# Altium schematic sheet DAC.SchDoc
size A4; SheetNumber: 8; SheetTotal: 11
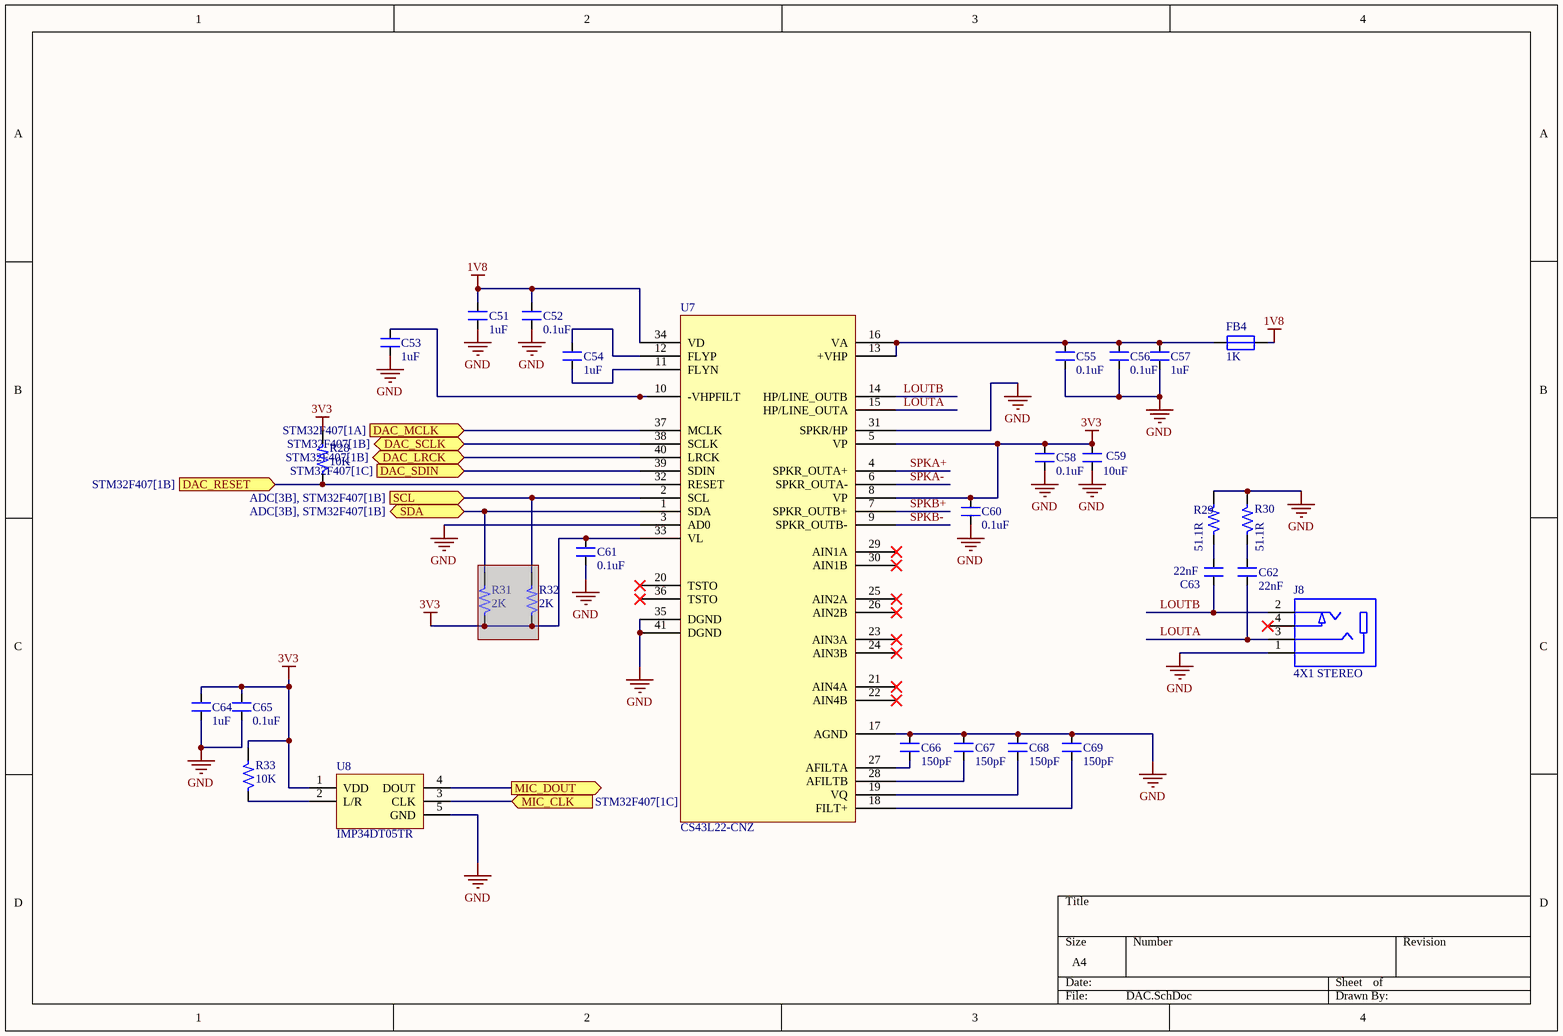
[diagram p0: DAC.SchDoc]

## Parts
C51  1uF  [CAP_0805]
C52  0.1uF  [CAP_0805]
C53  1uF  [CAP_0805]
C54  1uF  [CAP_0805]
C55  0.1uF  [CAP_0805]
C56  0.1uF  [CAP_0805]
C57  1uF  [CAP_0805]
C58  0.1uF  [CAP_0805]
C59  10uF  [CAP_1206]
C60  0.1uF  [CAP_0805]
C61  0.1uF  [CAP_0805]
C62  22nF  [CAP_0805]
C63  22nF  [CAP_0805]
C64  1uF  [CAP_0805]
C65  0.1uF  [CAP_0805]
C66  150pF  [CAP_0805]
C67  150pF  [CAP_0805]
C68  150pF  [CAP_0805]
C69  150pF  [CAP_0805]
FB4  1K  [IND_0805]
J8  4X1 STEREO  [CON_SJ-2504A-SMT-TR_SMD]
R28  10K  [RES_0603]
R29  51.1R  [RES_0603]
R30  51.1R  [RES_0603]
R31  2K  [RES_0603]  (masked out: inside a compile mask, not in the netlist)
R32  2K  [RES_0603]  (masked out: inside a compile mask, not in the netlist)
R33  10K  [RES_0603]
U7  CS43L22-CNZ  [QFN40_19_284_33X9_SMD]
U8  IMP34DT05TR  [HCLGA-4_53_137_15X37_SMD]

## Ports
DAC_LRCK (bidir, see STM32F407[1B]), DAC_MCLK (in, see STM32F407[1A]), DAC_RESET (in, see STM32F407[1B]), DAC_SCLK (bidir, see STM32F407[1B]), DAC_SDIN (in, see STM32F407[1C]), MIC_CLK (in, see STM32F407[1C]), MIC_DOUT (out), SCL (in, see ADC[3B], STM32F407[1B]), SDA (bidir, see ADC[3B], STM32F407[1B])

## Nets
1V8: C51.2 C52.2 FB4.2 U7.34(VD)
3V3: C58.2 C59.2 C60.2 C61.2 C64.2 C65.2 R28.2 R33.2 U7.5(VP) U7.8(VP) U7.33(VL) U8.1(VDD)
GND: C51.1 C52.1 C53.1 C55.1 C56.1 C57.1 C58.1 C59.1 C60.1 C61.1 C64.1 C65.1 C66.2 C67.2 C68.2 C69.2 J8.1 R29.2 R30.2 U7.3(AD0) U7.17(AGND) U7.31(SPKR/HP) U7.35(DGND) U7.41(DGND) U8.5(GND)
DAC_LRCK: U7.40(LRCK) ; port DAC_LRCK
DAC_MCLK: U7.37(MCLK) ; port DAC_MCLK
DAC_RESET: R28.1 U7.32(RESET) ; port DAC_RESET
DAC_SCLK: U7.38(SCLK) ; port DAC_SCLK
DAC_SDIN: U7.39(SDIN) ; port DAC_SDIN
LOUTA: C62.1 J8.3 U7.15(HP/LINE_OUTA)
LOUTB: C63.1 J8.2 U7.14(HP/LINE_OUTB)
MIC_CLK: U8.3(CLK) ; port MIC_CLK
MIC_DOUT: U8.4(DOUT) ; port MIC_DOUT
SCL: U7.2(SCL) ; port SCL
SDA: U7.1(SDA) ; port SDA
SPKA+: U7.4(SPKR_OUTA+)
SPKA-: U7.6(SPKR_OUTA-)
SPKB+: U7.7(SPKR_OUTB+)
SPKB-: U7.9(SPKR_OUTB-)
NetC53_2: C53.2 U7.10(-VHPFILT)
NetC54_1: C54.1 U7.11(FLYN)
NetC54_2: C54.2 U7.12(FLYP)
NetC55_2: C55.2 C56.2 C57.2 FB4.1 U7.13(+VHP) U7.16(VA)
NetC62_2: C62.2 R30.1
NetC63_2: C63.2 R29.1
NetC66_1: C66.1 U7.27(AFILTA)
NetC67_1: C67.1 U7.28(AFILTB)
NetC68_1: C68.1 U7.19(VQ)
NetC69_1: C69.1 U7.18(FILT+)
NetR33_1: R33.1 U8.2(L/R)

Not connected (* = marked no-connect by the designer): J8 4*; U7 20(TSTO)* 21(AIN4A)* 22(AIN4B)* 23(AIN3A)* 24(AIN3B)* 25(AIN2A)* 26(AIN2B)* 29(AIN1A)* 30(AIN1B)* 36(TSTO)*

## Library data of the parts
C51 C53 C54 C57 C64 = CAP_1uF-50V-5%-0805: 1µF ±5% 50V Ceramic Capacitor X7R 0805 (2012 Metric); Manufacturer: Samsung; Manufacturer Part Number: CC0805JKX7R9BB105; Alternate Part Number-1: 0805F105M500NT; Case/Package: 0805; Supplier-1: SIRICOM; Supplier Part Number-1: CL21B105KBFNNNE
C52 C55 C56 C58 C60 C61 C65 = CAP_0.1uF-50V-10%-0805: 0.1µF ±10% 50V Ceramic Capacitor X7R 0805 (2012 Metric); Manufacturer: Samsung; Manufacturer Part Number: CL21B104KBCNNNC; Alternate Part Number-1: NA; Case/Package: 0805; Supplier-1: SIRICOM; Supplier Part Number-1: 0805B104K500CT
C59 = CAP_10uF-50V-10%-1206: 10µF ±10% 50V Ceramic Capacitor X7R 1206 (3216 Metric); Manufacturer: KEMET; Manufacturer Part Number: CL31B106KBHNNNE; Alternate Part Number-1: GRT31CR61H106ME01L; Case/Package: 1206; Supplier-1: SIRICOM; Supplier Part Number-1: CC1206KKX5R9BB106
C62 C63 = CAP_22nF-50V-10%-0805: 0.022µF ±10% 50V Ceramic Capacitor X7R 0805 (2012 Metric); Manufacturer: Samsung Electro-Mechanics; Manufacturer Part Number: CL21B223KBANNNC; Alternate Part Number-1: NA; Case/Package: 0805; Supplier-1: Digikey; Supplier Part Number-1: 1276-1081-1-ND - Cut Tape (CT)
C66-C69 = CAP_150pF-50V-10%-0805: 150pF ±10% 50V Ceramic Capacitor C0G, NP0 0805 (2012 Metric); Manufacturer: AVX Corporation; Manufacturer Part Number: 08055A151KAT2A; Alternate Part Number-1: NA; Case/Package: 0805; Supplier-1: Digikey; Supplier Part Number-1: 478-10501-1-ND - Cut Tape (CT)
FB4 = FB_1K-100MHZ-1.6A-0805: 1 kOhms @ 100MHz 1 Power Line Ferrite Bead 0805 (2012 Metric) 1.6A; Manufacturer: Laird; Manufacturer Part Number: BLM21SP102SH1D; Alternate Part Number-1: NA; Case/Package: 0805; Supplier-1: SIRICOM; Supplier Part Number-1: ACMS201209A102
J8 = CON-PLG-STEREO_4X1-100-RA-SMD: 2.50mm (0.094", 3/32", Sub Mini, Miniature) - Headphone Phone Jack Stereo (4 Conductor, TRRS) Connector Solder; Manufacturer: CUI Devices; Manufacturer Part Number: SJ-2504A-SMT-TR; Alternate Part Number-1: NA; Case/Package: SMD; Supplier Part Number-1: CP-SJ-2504A-SMT-CT-ND - Cut Tape (CT); Supplier-1: Digikey
R28 R33 = RES_10K-0.1W-1%-0603: 10 kOhms ±1% 0.1W, 1/10W Chip Resistor 0603 (1608 Metric) Automotive AEC-Q200 Thick Film; Manufacturer: Walsin; Manufacturer Part Number: WR06X1002FTL; Alternate Part Number-1: 0603WAJ0103T5E; Case/Package: 0603; Supplier-1: SIRICOM; Supplier Part Number-1: WR06X1002FTL
R29 R30 = RES_51.1R-0.1W-1%-0603: 51.1 Ohms ±1% 0.1W, 1/10W Chip Resistor 0603 (1608 Metric) Thick Film; Manufacturer: Vishay Dale; Manufacturer Part Number: CRCW060351R1FKEAC; Alternate Part Number-1: NA; Case/Package: 0603; Supplier-1: Digikey; Supplier Part Number-1: 541-5468-1-ND - Cut Tape (CT)
R31 R32 = RES_2K-0.125W-1%-0603: 2 kOhms ±1% 0.125W, 1/8W Chip Resistor 0603 (1608 Metric) Anti-Sulfur, Moisture Resistant Thin Film; Manufacturer: Stackpole Electronics; Manufacturer Part Number: RNCP0603FTD2K00; Alternate Part Number-1: NA; Case/Package: 0603; Supplier-1: SIRICOM; Supplier Part Number-1: WR06X2001FTL
U7 = IC_CS43L22: Audio D/A Converter ICs Low Power Stereo DAC w/ClassD Spkr Driver; Manufacturer: Cirrus Logic; Alternate Part Number-1: NA; Manufacturer Part Number: CS43L22-CNZ; Case/Package: QFN-40; Supplier-1: Mouser; Supplier Part Number-1: 777-CS43L22-CNZ
U8 = IC_IMP34DT05TR: MEMS Microphones AUTO & INDUSTRIAL SENSORS; Manufacturer: STMicroelectronics; Alternate Part Number-1: NA; Manufacturer Part Number: IMP34DT05TR; Case/Package: HCLGA-4; Supplier-1: Mouser; Supplier Part Number-1: 511-IMP34DT05TR